# EasyEDA schematic SCH_enigma_2022-11-20.json
TITLE: enigma machine; REV: 1.0; Date: 19-11-2022; Sheet: 1/1; Drawn By: HanneVerschueren; Company: Thomas More
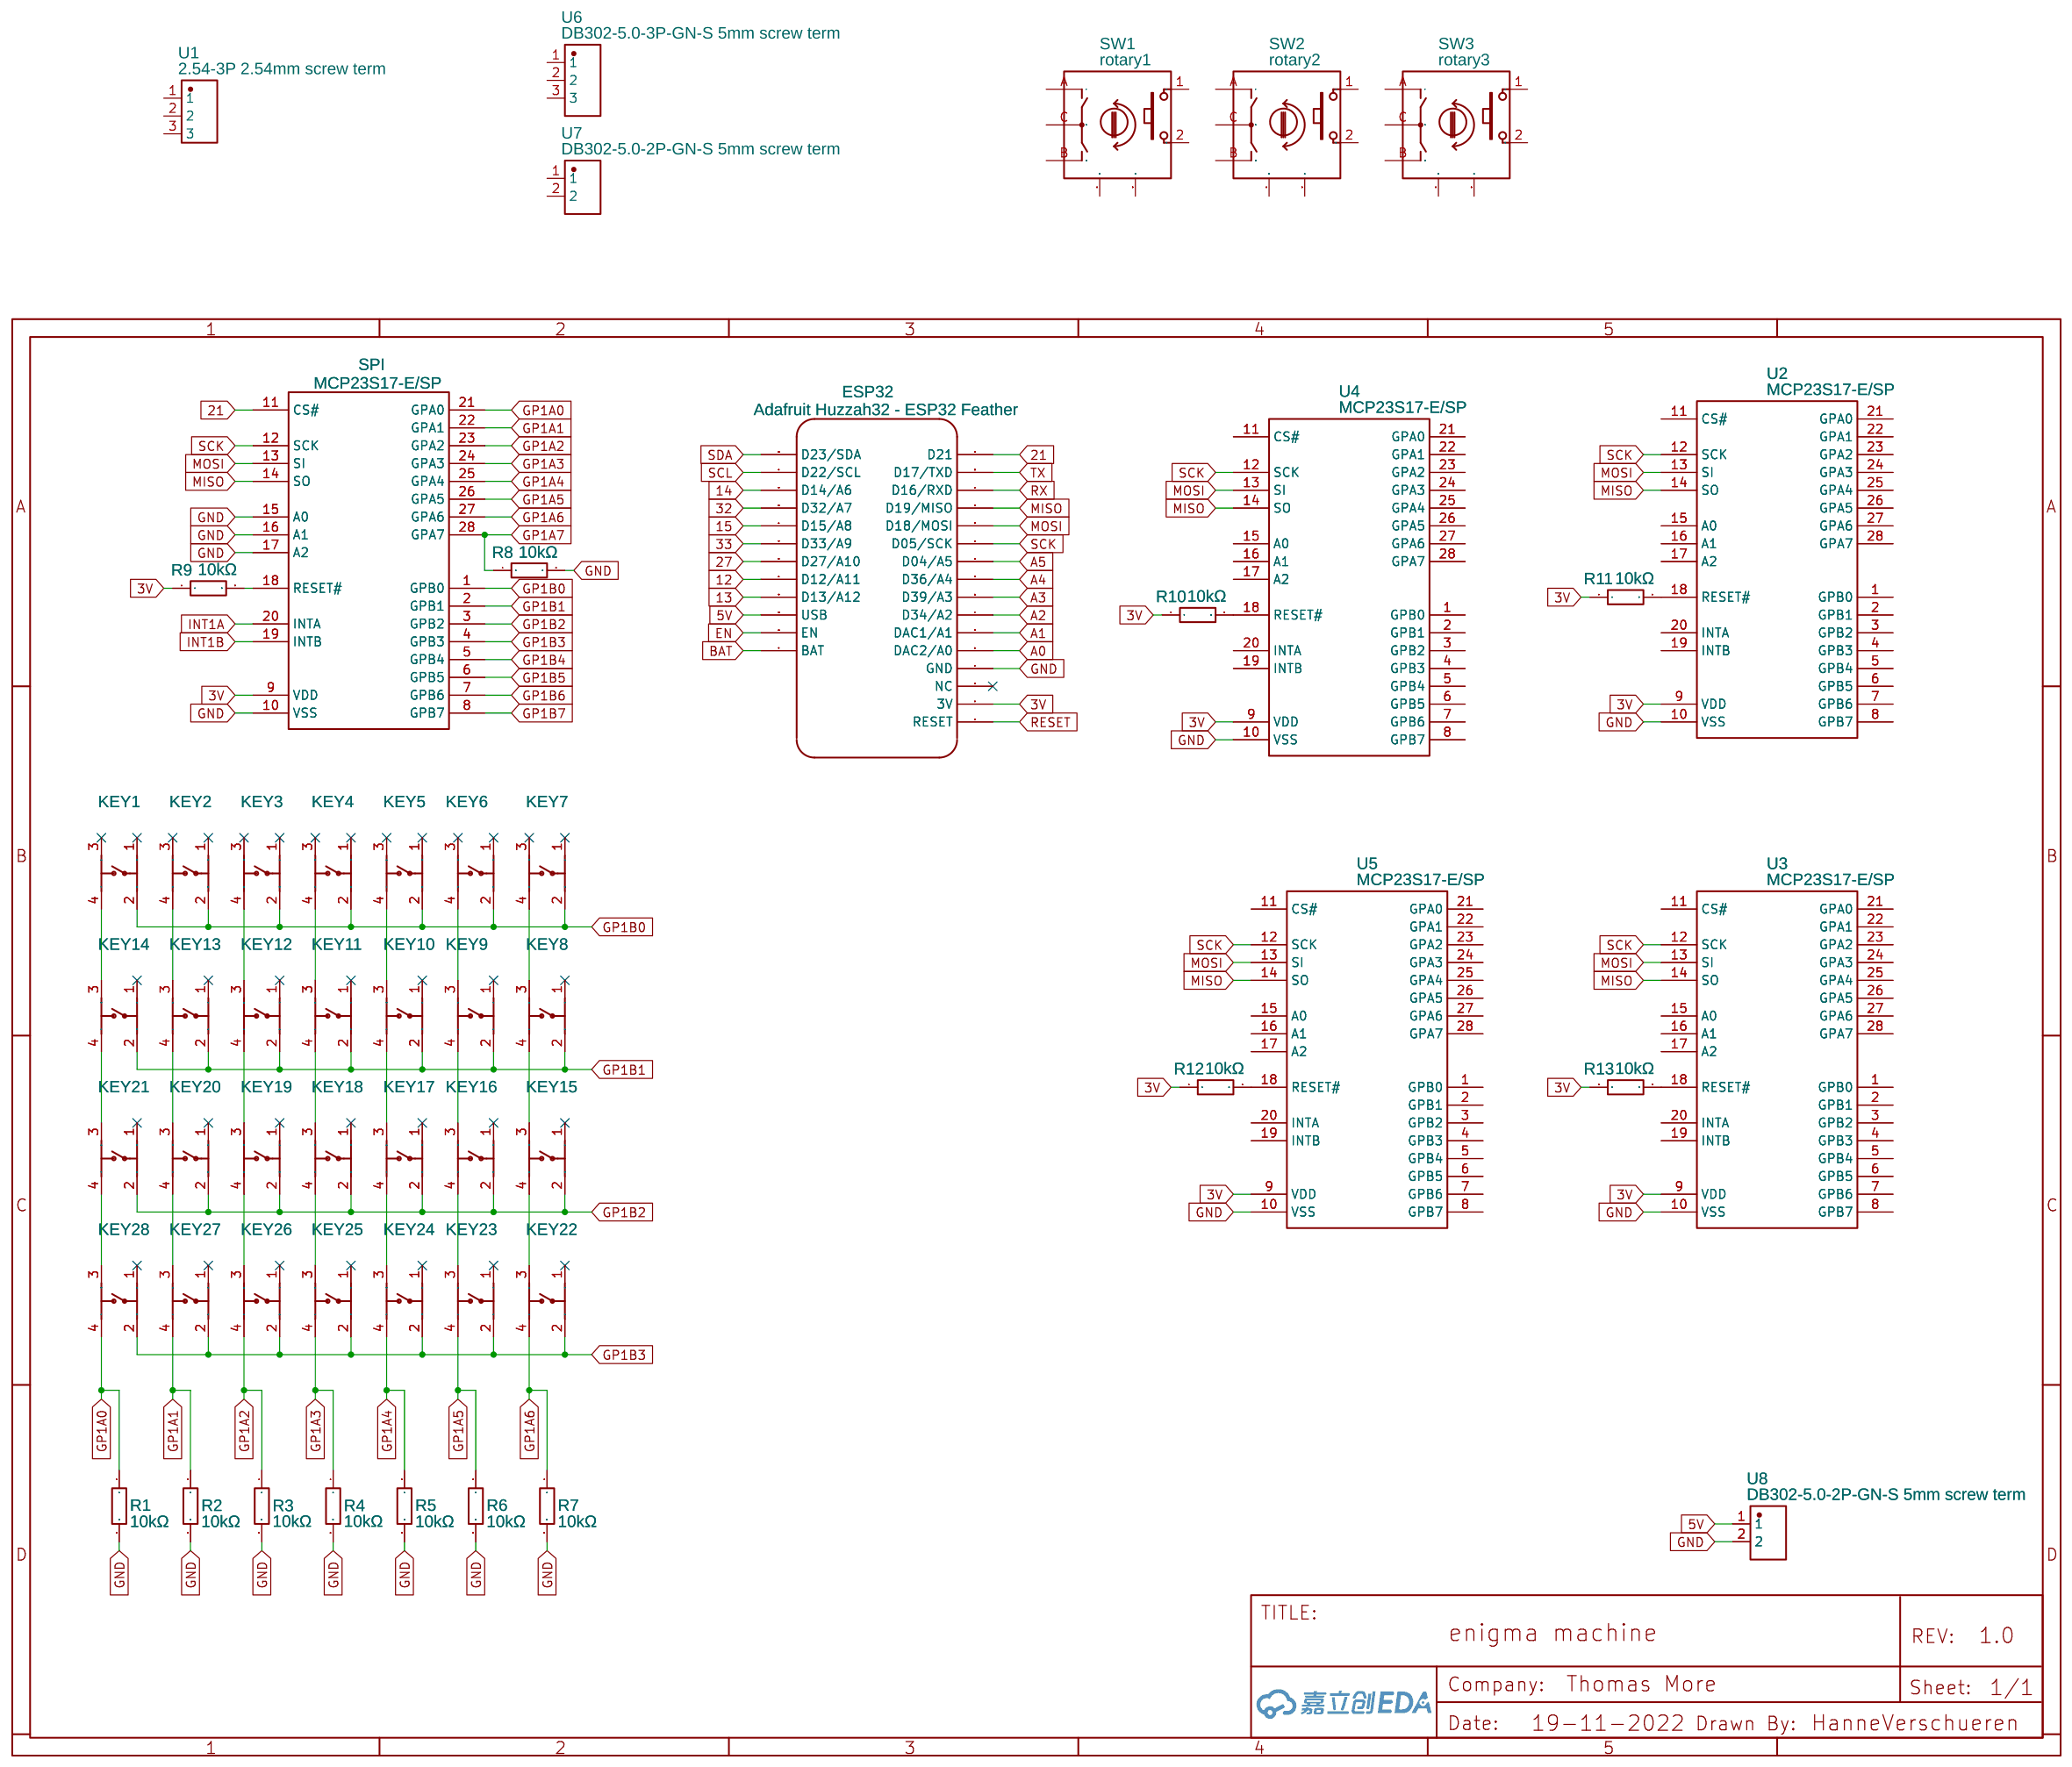
[diagram p0: schematic sheet]

## Parts
ESP32  Adafruit Huzzah32 - ESP32 Feather  [ADAFRUIT HUZZAH32 - ESP32 FEATHER]
KEY1  12*12*7.3  [KEY-SMD_4P-L12.0-W12.0-P5.00-LS15.4]
KEY2  12*12*7.3  [KEY-SMD_4P-L12.0-W12.0-P5.00-LS15.4]
KEY3  12*12*7.3  [KEY-SMD_4P-L12.0-W12.0-P5.00-LS15.4]
KEY4  12*12*7.3  [KEY-SMD_4P-L12.0-W12.0-P5.00-LS15.4]
KEY5  12*12*7.3  [KEY-SMD_4P-L12.0-W12.0-P5.00-LS15.4]
KEY6  12*12*7.3  [KEY-SMD_4P-L12.0-W12.0-P5.00-LS15.4]
KEY7  12*12*7.3  [KEY-SMD_4P-L12.0-W12.0-P5.00-LS15.4]
KEY8  12*12*7.3  [KEY-SMD_4P-L12.0-W12.0-P5.00-LS15.4]
KEY9  12*12*7.3  [KEY-SMD_4P-L12.0-W12.0-P5.00-LS15.4]
KEY10  12*12*7.3  [KEY-SMD_4P-L12.0-W12.0-P5.00-LS15.4]
KEY11  12*12*7.3  [KEY-SMD_4P-L12.0-W12.0-P5.00-LS15.4]
KEY12  12*12*7.3  [KEY-SMD_4P-L12.0-W12.0-P5.00-LS15.4]
KEY13  12*12*7.3  [KEY-SMD_4P-L12.0-W12.0-P5.00-LS15.4]
KEY14  12*12*7.3  [KEY-SMD_4P-L12.0-W12.0-P5.00-LS15.4]
KEY15  12*12*7.3  [KEY-SMD_4P-L12.0-W12.0-P5.00-LS15.4]
KEY16  12*12*7.3  [KEY-SMD_4P-L12.0-W12.0-P5.00-LS15.4]
KEY17  12*12*7.3  [KEY-SMD_4P-L12.0-W12.0-P5.00-LS15.4]
KEY18  12*12*7.3  [KEY-SMD_4P-L12.0-W12.0-P5.00-LS15.4]
KEY19  12*12*7.3  [KEY-SMD_4P-L12.0-W12.0-P5.00-LS15.4]
KEY20  12*12*7.3  [KEY-SMD_4P-L12.0-W12.0-P5.00-LS15.4]
KEY21  12*12*7.3  [KEY-SMD_4P-L12.0-W12.0-P5.00-LS15.4]
KEY22  12*12*7.3  [KEY-SMD_4P-L12.0-W12.0-P5.00-LS15.4]
KEY23  12*12*7.3  [KEY-SMD_4P-L12.0-W12.0-P5.00-LS15.4]
KEY24  12*12*7.3  [KEY-SMD_4P-L12.0-W12.0-P5.00-LS15.4]
KEY25  12*12*7.3  [KEY-SMD_4P-L12.0-W12.0-P5.00-LS15.4]
KEY26  12*12*7.3  [KEY-SMD_4P-L12.0-W12.0-P5.00-LS15.4]
KEY27  12*12*7.3  [KEY-SMD_4P-L12.0-W12.0-P5.00-LS15.4]
KEY28  12*12*7.3  [KEY-SMD_4P-L12.0-W12.0-P5.00-LS15.4]
R1  10kΩ  [R0603]
R2  10kΩ  [R0603]
R3  10kΩ  [R0603]
R4  10kΩ  [R0603]
R5  10kΩ  [R0603]
R6  10kΩ  [R0603]
R7  10kΩ  [R0603]
R8  10kΩ  [R0603]
R9  10kΩ  [R0603]
R10  10kΩ  [R0603]
R11  10kΩ  [R0603]
R12  10kΩ  [R0603]
R13  10kΩ  [R0603]
SPI  MCP23S17-E/SP  [DIP-28_L34.6-W7.3-P2.54-LS10.2-BL]
SW1  rotary1  [SW-TH_PEC11R-4XXXF-SXXXX]
SW2  rotary2  [SW-TH_PEC11R-4XXXF-SXXXX]
SW3  rotary3  [SW-TH_PEC11R-4XXXF-SXXXX]
U1  2.54-3P 2.54mm screw term  [CONN-TH_2.54-3P]
U2  MCP23S17-E/SP  [DIP-28_L34.6-W7.3-P2.54-LS10.2-BL]
U3  MCP23S17-E/SP  [DIP-28_L34.6-W7.3-P2.54-LS10.2-BL]
U4  MCP23S17-E/SP  [DIP-28_L34.6-W7.3-P2.54-LS10.2-BL]
U5  MCP23S17-E/SP  [DIP-28_L34.6-W7.3-P2.54-LS10.2-BL]
U6  DB302-5.0-3P-GN-S 5mm screw term  [CONN-TH_DB302-5.0-3P]
U7  DB302-5.0-2P-GN-S 5mm screw term  [CONN-TH_DB302-5.0-2P]
U8  DB302-5.0-2P-GN-S 5mm screw term  [CONN-TH_DB302-5.0-2P]

## Library data of the parts
ESP32 = Adafruit Huzzah32 - ESP32 Feather: Manufacturer: Adafruit; Manufacturer Part: 3405; Supplier: Mouser; Supplier Part: 485-3405; link: https://www.mouser.com/ProductDetail/Adafruit/3405?qs=sGAEpiMZZMve4%2FbfQkoj%252BL%2FMP7pCYZmkSYGzew1l%252BSY%3D; Contributor: jsicore
KEY1-KEY28 = 12*12*7.3: Supplier: LCSC; Manufacturer: ReliaPro; Supplier Part: C41103; JLCPCB Part Class: Extended Part
R1-R13 = RS-03K103JT: Supplier: LCSC; Manufacturer: FH; Supplier Part: C73809; Resistance (Ohms): 10K; JLCPCB Part Class: Extended Part
SPI U2-U5 = MCP23S17-E/SP: Supplier: LCSC; Manufacturer: MICROCHIP; Contributor: LCSC; Supplier Part: C148096; JLCPCB Part Class: Extended Part
SW1-SW3 = PEC11R-4015F-S0024: Supplier: LCSC; Supplier Part: C143789; Manufacturer: BOURNS; Contributor: LCSC; JLCPCB Part Class: Extended Part
U1 = 2.54-3P: Supplier: LCSC; Supplier Part: C68305; Manufacturer: BOOMELE(博穆精密); Manufacturer Part: 2.54-3P接线端子; Contributor: LCSC; JLCPCB Part Class: Extended Part
U6 = DB302-5.0-3P-GN-S: Supplier: LCSC; Supplier Part: C2997276; Manufacturer: DIBO(地博电气); link: https://atta.szlcsc.com/upload/public/pdf/source/20220418/F63E4822E301FF035E2D9136E480A4B5.pdf; Contributor: lcsc; JLCPCB Part Class: Extended Part
U7 U8 = DB302-5.0-2P-GN-S: Supplier: LCSC; Supplier Part: C2997275; Manufacturer: DIBO(地博电气); link: https://atta.szlcsc.com/upload/public/pdf/source/20220418/F63E4822E301FF035E2D9136E480A4B5.pdf; Contributor: lcsc; JLCPCB Part Class: Extended Part

## Nets
3V: ESP32.2(3V) R9.1 R10.1 R11.1 R12.1 R13.1 SPI.9(VDD) U2.9(VDD) U3.9(VDD) U4.9(VDD) U5.9(VDD)
5V: ESP32.19(USB) U8.1
GND: ESP32.4(GND) R1.2 R2.2 R3.2 R4.2 R5.2 R6.2 R7.2 R8.2 SPI.10(VSS) SPI.15(A0) SPI.16(A1) SPI.17(A2) U2.10(VSS) U3.10(VSS) U4.10(VSS) U5.10(VSS) U8.2
12: ESP32.21(D12/A11)
13: ESP32.20(D13/A12)
14: ESP32.26(D14/A6)
15: ESP32.24(D15/A8)
21: ESP32.16(D21) SPI.11(CS#)
27: ESP32.22(D27/A10)
32: ESP32.25(D32/A7)
33: ESP32.23(D33/A9)
A0: ESP32.5(DAC2/A0)
A1: ESP32.6(DAC1/A1)
A2: ESP32.7(D34/A2)
A3: ESP32.8(D39/A3)
A4: ESP32.9(D36/A4)
A5: ESP32.10(D04/A5)
BAT: ESP32.17(BAT)
EN: ESP32.18(EN)
GP1A0: KEY28.4 R1.1 SPI.21(GPA0)
GP1A1: KEY27.4 R2.1 SPI.22(GPA1)
GP1A2: KEY26.4 R3.1 SPI.23(GPA2)
GP1A3: KEY25.4 R4.1 SPI.24(GPA3)
GP1A4: KEY24.4 R5.1 SPI.25(GPA4)
GP1A5: KEY23.4 R6.1 SPI.26(GPA5)
GP1A6: KEY22.4 R7.1 SPI.27(GPA6)
GP1A7: R8.1 SPI.28(GPA7)
GP1B0: KEY1.2 KEY2.2 KEY3.2 KEY4.2 KEY5.2 KEY6.2 KEY7.2 SPI.1(GPB0)
GP1B1: KEY8.2 KEY9.2 KEY10.2 KEY11.2 KEY12.2 KEY13.2 KEY14.2 SPI.2(GPB1)
GP1B2: KEY15.2 KEY16.2 KEY17.2 KEY18.2 KEY19.2 KEY20.2 KEY21.2 SPI.3(GPB2)
GP1B3: KEY22.2 KEY23.2 KEY24.2 KEY25.2 KEY26.2 KEY27.2 KEY28.2 SPI.4(GPB3)
GP1B4: SPI.5(GPB4)
GP1B5: SPI.6(GPB5)
GP1B6: SPI.7(GPB6)
GP1B7: SPI.8(GPB7)
INT1A: SPI.20(INTA)
INT1B: SPI.19(INTB)
MISO: ESP32.13(D19/MISO) SPI.14(SO) U2.14(SO) U3.14(SO) U4.14(SO) U5.14(SO)
MOSI: ESP32.12(D18/MOSI) SPI.13(SI) U2.13(SI) U3.13(SI) U4.13(SI) U5.13(SI)
RESET: ESP32.1(RESET)
RX: ESP32.14(D16/RXD)
SCK: ESP32.11(D05/SCK) SPI.12(SCK) U2.12(SCK) U3.12(SCK) U4.12(SCK) U5.12(SCK)
SCL: ESP32.27(D22/SCL)
SDA: ESP32.28(D23/SDA)
TX: ESP32.15(D17/TXD)
Net-(KEY1-4): KEY1.4 KEY14.3
Net-(KEY2-4): KEY2.4 KEY13.3
Net-(KEY3-4): KEY3.4 KEY12.3
Net-(KEY4-4): KEY4.4 KEY11.3
Net-(KEY5-4): KEY5.4 KEY10.3
Net-(KEY6-4): KEY6.4 KEY9.3
Net-(KEY7-4): KEY7.4 KEY8.3
Net-(KEY8-4): KEY8.4 KEY15.3
Net-(KEY9-4): KEY9.4 KEY16.3
Net-(KEY10-4): KEY10.4 KEY17.3
Net-(KEY11-4): KEY11.4 KEY18.3
Net-(KEY12-4): KEY12.4 KEY19.3
Net-(KEY13-4): KEY13.4 KEY20.3
Net-(KEY14-4): KEY14.4 KEY21.3
Net-(KEY15-4): KEY15.4 KEY22.3
Net-(KEY16-4): KEY16.4 KEY23.3
Net-(KEY17-4): KEY17.4 KEY24.3
Net-(KEY18-4): KEY18.4 KEY25.3
Net-(KEY19-4): KEY19.4 KEY26.3
Net-(KEY20-4): KEY20.4 KEY27.3
Net-(KEY21-4): KEY21.4 KEY28.3
Net-(R9-2): R9.2 SPI.18(RESET#)
Net-(R10-2): R10.2 U4.18(RESET#)
Net-(R11-2): R11.2 U2.18(RESET#)
Net-(R12-2): R12.2 U5.18(RESET#)
Net-(R13-2): R13.2 U3.18(RESET#)

Not connected (* = marked no-connect by the designer): ESP32 3(NC)*; KEY1 1* 3*; KEY2 1* 3*; KEY3 1* 3*; KEY4 1* 3*; KEY5 1* 3*; KEY6 1* 3*; KEY7 1* 3*; KEY8 1*; KEY9 1*; KEY10 1*; KEY11 1*; KEY12 1*; KEY13 1*; KEY14 1*; KEY15 1*; KEY16 1*; KEY17 1*; KEY18 1*; KEY19 1*; KEY20 1*; KEY21 1*; KEY22 1*; KEY23 1*; KEY24 1*; KEY25 1*; KEY26 1*; KEY27 1*; KEY28 1*; SW1 1 2 A B C MT1 MT2; SW2 1 2 A B C MT1 MT2; SW3 1 2 A B C MT1 MT2; U1 1 2 3; U2 1(GPB0) 2(GPB1) 3(GPB2) 4(GPB3) 5(GPB4) 6(GPB5) 7(GPB6) 8(GPB7) 11(CS#) 15(A0) 16(A1) 17(A2) 19(INTB) 20(INTA) 21(GPA0) 22(GPA1) 23(GPA2) 24(GPA3) 25(GPA4) 26(GPA5) 27(GPA6) 28(GPA7); U3 1(GPB0) 2(GPB1) 3(GPB2) 4(GPB3) 5(GPB4) 6(GPB5) 7(GPB6) 8(GPB7) 11(CS#) 15(A0) 16(A1) 17(A2) 19(INTB) 20(INTA) 21(GPA0) 22(GPA1) 23(GPA2) 24(GPA3) 25(GPA4) 26(GPA5) 27(GPA6) 28(GPA7); U4 1(GPB0) 2(GPB1) 3(GPB2) 4(GPB3) 5(GPB4) 6(GPB5) 7(GPB6) 8(GPB7) 11(CS#) 15(A0) 16(A1) 17(A2) 19(INTB) 20(INTA) 21(GPA0) 22(GPA1) 23(GPA2) 24(GPA3) 25(GPA4) 26(GPA5) 27(GPA6) 28(GPA7); U5 1(GPB0) 2(GPB1) 3(GPB2) 4(GPB3) 5(GPB4) 6(GPB5) 7(GPB6) 8(GPB7) 11(CS#) 15(A0) 16(A1) 17(A2) 19(INTB) 20(INTA) 21(GPA0) 22(GPA1) 23(GPA2) 24(GPA3) 25(GPA4) 26(GPA5) 27(GPA6) 28(GPA7); U6 1 2 3; U7 1 2
